# Altium schematic sheet 04_ DAC & ADC.SchDoc
size 420 x 297 mm; SheetNumber: 4; SheetTotal: 4
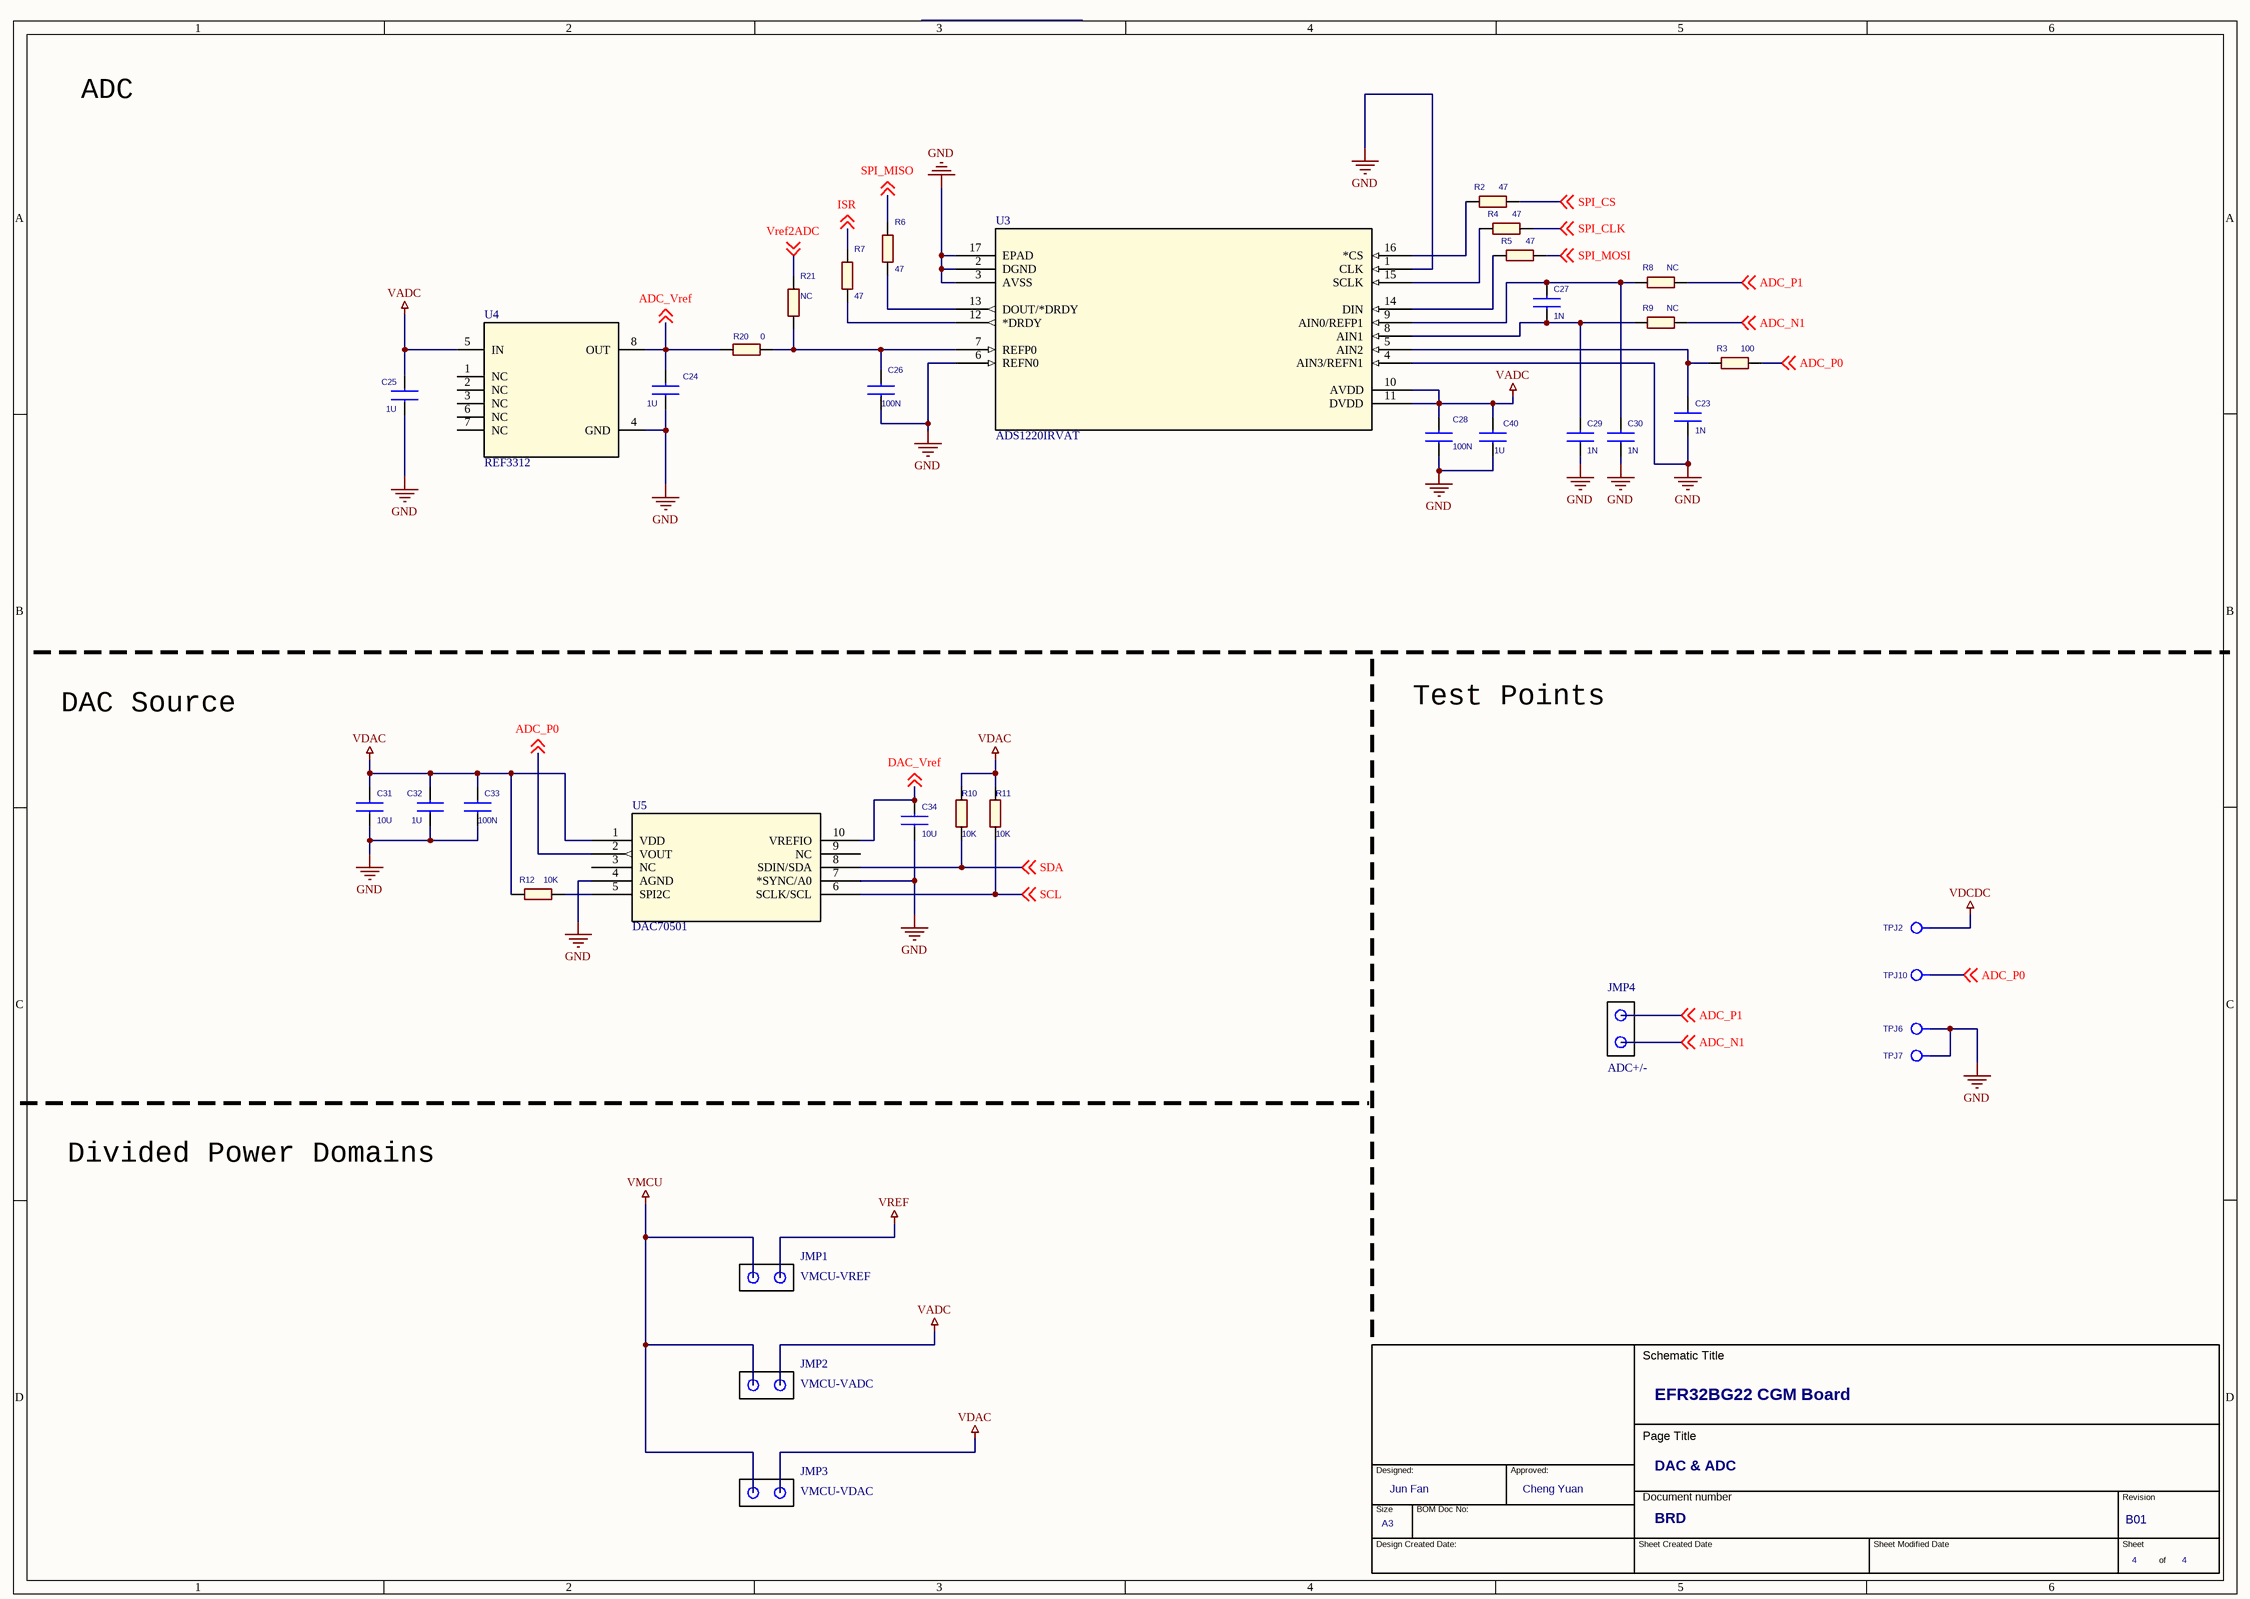
[diagram p0: 04_ DAC & ADC.SchDoc]

## Parts
*?  OrgAddr2: Cheng Yuan  OrgAddr1: Jun Fan  Page Count: 4  Doc: BRD  Title: EFR32BG22 CGM Board  RevCode: B01  Page Size: A3  Page Title: DAC & ADC  (hidden comment: TitleBlock_SiLabs_A3)  (graphical)
C23  1N  [C0201_L]
C24  1U  [C0402_L]
C25  1U  [C0402_L]
C26  100N  [C0201_L]
C27  1N  [C0201_L]
C28  100N  [C0201_L]
C29  1N  [C0201_L]
C30  1N  [C0201_L]
C31  10U  [C0603_L]
C32  1U  [C0402_L]
C33  100N  [C0201_L]
C34  10U  [C0603_L]
C40  1U  [C0402_L]
JMP1  VMCU-VREF  [2Pin-JMP]
JMP2  VMCU-VADC  [2Pin-JMP]
JMP3  VMCU-VDAC  [2Pin-JMP]
JMP4  ADC+/-  [2Pin-JMP]
R2  47  [R0402_L]
R3  100  [R0402_L]
R4  47  [R0402_L]
R5  47  [R0402_L]
R6  47  [R0402_L]
R7  47  [R0402_L]
R8  NC  [R0402_L]
R9  NC  [R0402_L]
R10  10K  [R0402_L]
R11  10K  [R0402_L]
R12  10K  [R0402_L]
R20  0  [R0402_L]
R21  NC  [R0402_L]
TPJ2  VDC  [TP_1.0_SMD]  (value not drawn)
TPJ6  GND  [TP_1.0_SMD]  (value not drawn)
TPJ7  GND  [TP_1.0_SMD]  (value not drawn)
TPJ10  A_P0  [TP_1.0_SMD]  (value not drawn)
U3  ADS1220IRVAT  [RVA16_2P14X2P14]
U4  REF3312  [RSE0008A]
U5  DAC70501  [DGS10_TEX]

## Nets
GND: C23.2 C24.2 C25.2 C26.2 C28.2 C29.2 C30.2 C31.2 C32.2 C33.2 C34.2 C40.2 TPJ6.1(TP) TPJ7.1(TP) U3.1(CLK) U3.2(DGND) U3.3(AVSS) U3.4(AIN3/REFN1) U3.6(REFN0) U3.17(EPAD) U4.4(GND) U5.4(AGND) U5.7(*SYNC/A0)
VADC: C25.1 C28.1 C40.1 JMP2.2(TP) U3.10(AVDD) U3.11(DVDD) U4.5(IN)
VDAC: C31.1 C32.1 C33.1 JMP3.2(TP) R10.1 R11.1 R12.1 U5.1(VDD)
VDCDC: TPJ2.1(TP)
VMCU: JMP1.1(TP) JMP2.1(TP) JMP3.1(TP)
VREF: JMP1.2(TP)
ADC_N1: JMP4.2(TP) R9.2 ; off-sheet ADC_N1
ADC_P0: R3.2 TPJ10.1(TP) U5.2(VOUT) ; off-sheet ADC_P0
ADC_P1: JMP4.1(TP) R8.2 ; off-sheet ADC_P1
ADC_Vref: C24.1 R20.2 U4.8(OUT) ; off-sheet ADC_Vref
DAC_Vref: C34.1 U5.10(VREFIO) ; off-sheet DAC_Vref
ISR: R7.1 ; off-sheet ISR
SCL: R11.2 U5.6(SCLK/SCL) ; off-sheet SCL
SDA: R10.2 U5.8(SDIN/SDA) ; off-sheet SDA
SPI_CLK: R4.2 ; off-sheet SPI_CLK
SPI_CS: R2.2 ; off-sheet SPI_CS
SPI_MISO: R6.1 ; off-sheet SPI_MISO
SPI_MOSI: R5.2 ; off-sheet SPI_MOSI
Vref2ADC: R21.2 ; off-sheet Vref2ADC
NetC23_1: C23.1 R3.1 U3.5(AIN2)
NetC26_1: C26.1 R20.1 R21.1 U3.7(REFP0)
NetC27_1: C27.1 C30.1 R8.1 U3.9(AIN0/REFP1)
NetC27_2: C27.2 C29.1 R9.1 U3.8(AIN1)
NetR2_1: R2.1 U3.16(*CS)
NetR4_1: R4.1 U3.15(SCLK)
NetR5_1: R5.1 U3.14(DIN)
NetR6_2: R6.2 U3.13(DOUT/*DRDY)
NetR7_2: R7.2 U3.12(*DRDY)
NetR12_2: R12.2 U5.5(SPI2C)

Not connected (* = marked no-connect by the designer): U4 1(NC) 2(NC) 3(NC) 6(NC) 7(NC); U5 3(NC) 9(NC)

## Notes on the sheet
- ADC
- DAC Source
- Test Points
- Divided Power Domains
- (in symbol TitleBlock_SiLabs_A3) Schematic Title; Page Title; Designed:; Approved:; Document number; Revision; Size; BOM Doc No:; Design Created Date:; Sheet Created Date; Sheet Modified Date; Sheet; of

## Library data of the parts
*? = TitleBlock_SiLabs_A3: Cage Code: <Cage Code>; Page Number: 4
C23 C27 C29 C30 = C0201: Rating: 10V; Tolerance: 10%; Technology: X5R
C24-C26 C28 C32 C33 C40 = C0201: Rating: 25V; Tolerance: 10%; Technology: X5R
C31 C34 = C0603: Rating: 25V; Tolerance: 20%; Technology: X5R
JMP1-JMP4 = JMP-2P
R2-R12 R20 R21 = RESISTOR: Tolerance: 5%; Price_1K: 0.005
TPJ2 TPJ6 TPJ7 TPJ10 = TPJ_SMD_Dup1
U3 = ADS1220IRVAT: No Description Available; Mfg: Texas Instruments; Mfg #: ADS1220IRVAT; Copyright: Copyright (C) 2018 Accelerated Designs. All rights reserved; RefDes: RefDes; Type: DEV
U4 = REF3312AIRSET: No Description Available; PartNumber: REF3312AIRSER; Mfg: Texas Instruments; RefDes: RefDes; Type: DEV; Mfg #: REF3312AIRSET; Copyright: Copyright (C) 2018 Accelerated Designs. All rights reserved
U5 = DAC70501MDGST: No Description Available; Built_By: EMA_Molly; SourceLibrary: Texas_Instruments_2019-08-28; Mfg: Texas Instruments; Copyright: Copyright (C) 2018 Accelerated Designs. All rights reserved; RefDes: RefDes; Type: DEV; Mfg #: DAC70501MDGST